# Altium schematic sheet 12V.SchDoc
size A; DocumentNumber: 4; SheetNumber: 4; SheetTotal: 6
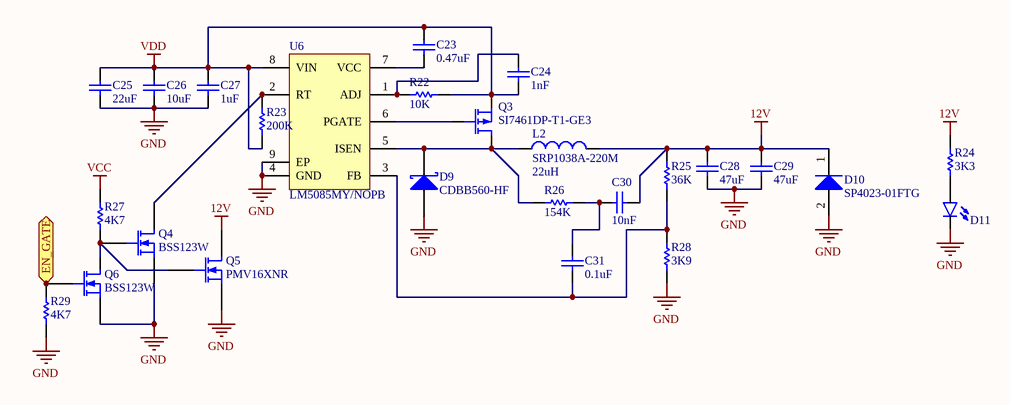
[diagram p0: 12V.SchDoc]

## Parts
C23  value 0.47uF  [C0603[1608X92]]  (hidden comment: 0.47uF 50V 0603)
C24  value 1nF  [C0402[1005X55]]  (hidden comment: 1nF 50V 0402)
C25  value 22uF  [C2220[5750X480]]  (hidden comment: 22uF 50V 2220)
C26  value 10uF  [C1206[3216X160]]  (hidden comment: 10uF 50V 1206)
C27  value 1uF  [C0603[1608X92]]  (hidden comment: 1uF 50V 0603)
C28  value 47uF  [C1210[3225X250]]  (hidden comment: 47uF 16V 1210)
C29  value 47uF  [C1210[3225X250]]  (hidden comment: 47uF 16V 1210)
C30  value 10nF  [C0402[1005X55]]  (hidden comment: 10nF 50V 0402)
C31  value 0.1uF  [C0402[1005X55]]  (hidden comment: 0.1uF 100VV 0402)
D9  CDBB560-HF  [SMB]
D10  SP4023-01FTG  [SOD323]
D11  LED-BLUE  [LED0603]  (value not drawn)
L2  SRP1038A-220M  value 22uH  [SRP1038A]
Q3  SI7461DP-T1-GE3  [SOT23-3]
Q4  BSS123W  [SOT323-3]
Q5  PMV16XNR  [SOT23-3]
Q6  BSS123W  [DPAK127P1525X483-7N]
R22  value 10K  [R0402[1005]]  (hidden comment: 10K 1% 0402)
R23  value 200K  [R0402[1005]]  (hidden comment: 200K 1% 0402)
R24  value 3K3  [R0402[1005]]  (hidden comment: 3K3 1% 0402)
R25  value 36K  [R0402[1005]]  (hidden comment: 36K 1% 0402)
R26  value 154K  [R0402[1005]]  (hidden comment: 154K 1% 0402)
R27  value 4K7  [R0402[1005]]  (hidden comment: 4K7 1% 0402)
R28  value 3K9  [R0402[1005]]  (hidden comment: 3K9 1% 0402)
R29  value 4K7  [R0402[1005]]  (hidden comment: 4K7 1% 0402)
U6  LM5085MY/NOPB  [MUY08A_N]

## Ports
EN_GATE (in)

## Nets
12V: C28.2 C29.2 C30.2 D10.1(K) L2.2 Q5.3(D) R24.2 R25.2
GND: C25.1 C26.1 C27.1 C28.1 C29.1 D9.1(A) D10.2(A) D11.C Q4.2(S) Q5.2(S) Q6.2(S) R28.1 R29.1 U6.4(GND) U6.9(EP)
VCC: R27.2
VDD: C23.2 C24.1 C25.2 C26.2 C27.2 Q3.3(S) R22.2 R23.1 U6.8(VIN)
EN_GATE: Q6.1(G) R29.2 ; port EN_GATE
NetC23_1: C23.1 U6.7(VCC)
NetC24_2: C24.2 R22.1 U6.1(ADJ)
NetC30_1: C30.1 C31.2 R26.2
NetC31_1: C31.1 R25.1 R28.2 U6.3(FB)
NetD9_2: D9.2(K) L2.1 Q3.2(D) R26.1 U6.5(ISEN)
NetD11_A: D11.A R24.1
NetQ3_1: Q3.1(G) U6.6(PGATE)
NetQ4_1: Q4.1(G) Q5.1(G) Q6.3(D) R27.1
NetQ4_3: Q4.3(D) R23.2 U6.2(RT)

## Library data of the parts
C23 = CAP_0.47uF_50V_0603_10%: 0.47uF 50V 10% 0603 (1608 Metric); PartNumber: GRM188R61H474KA12D; Manufacturer: Murata; Tolerance: 10%; Mounting Technology: Surface Mount; PackageReference: 0603; PackageDescription: 0603 (1608 Metric); Voltage: 50V
C24 = CAP_1nF_50V_0402_5%: 1nF 50V 5% 0402 (1005 Metric); PartNumber: GRM1555C1H102JA01D; Manufacturer: Murata; Tolerance: 5%; Mounting Technology: Surface Mount; PackageReference: 0402; PackageDescription: 0402 (1005 Metric); Voltage: 50V
C25 = CAP_22uF_50V_2220_20%: 22uF 50V 20% 2220 (5750 Metric); PartNumber: KRM55TR71H226MH01K; Manufacturer: Murata; Tolerance: 20%; Mounting Technology: Surface Mount; PackageReference: 2220; PackageDescription: 2220 (5750 Metric); Voltage: 50V
C26 = CAP_10uF_50V_1206_20%: 10uF 50V 20% 1206 (3216 Metric); PartNumber: UMK316BBJ106ML-T; Manufacturer: Taiyo Yuden; Tolerance: 20%; Mounting Technology: Surface Mount; PackageReference: 1206; PackageDescription: 1206 (3216 Metric); Voltage: 50V
C27 = CAP_1uF_50V_0603_10%: 1uF 50V 10% 0603 (1608 Metric); PartNumber: GRM188R61H105KAALD; Manufacturer: Murata; Tolerance: 10%; Mounting Technology: Surface Mount; PackageReference: 0603; PackageDescription: 0603 (1608 Metric); Voltage: 50V
C28 C29 = CAP_47uF_16V_1210_20%: 47uF 16V 20% 1210 (3225 Metric); PartNumber: GRM32ER61C476ME15L; Manufacturer: Murata; Tolerance: 20%; Mounting Technology: Surface Mount; PackageReference: 1210; PackageDescription: 1210 (3225 Metric); Voltage: 16V
C30 = CAP_10nF_50V_0402_10%: 10nF 50V 10% 0402 (1005 Metric); PartNumber: GCM155R71H103KA55D; Manufacturer: Murata; Tolerance: 10%; Mounting Technology: Surface Mount; PackageReference: 0402; PackageDescription: 0402 (1005 Metric); Voltage: 50V
C31 = CAP_0.1uF_100V_0402_10%: 0.1uF 100V 10% 0402 (1005 Metric); PartNumber: GRM155R62A104KE14D; Manufacturer: Murata; Tolerance: 10%; Mounting Technology: Surface Mount; PackageReference: 0402; PackageDescription: 0402 (1005 Metric); Voltage: 100V
D9 = CDBB560-HF: Manufacturer: Comchip Technology; PackageReference: DO-214AA; PackageDescription: DO-214-AA/SMB; 2 C-Bend Leads; Body 5.3 x 3.6 mm, inc. leads (LxW); PartNumber: CDBB560-HF; Mounting Technology: Surface Mount
D10 = SP4023-01FTG: Manufacturer: Littelfuse; PartNumber: SP4023-01FTG; PackageReference: SOD-323-2; PackageDescription: SOD323, 2-Leads; Mounting Technology: Surface Mount
D11 = LED_0603_BLUE_5mA: PartNumber: LTST-C193TBKT-5A; Manufacturer: Lite-On Inc.; PackageReference: 0603; PackageDescription: 0603 (1608 Metric); Mounting Technology: Surface Mount
L2 = SRP1038A-220M: 22uH 20% 7A 1038; Manufacturer: Bourns; PackageReference: SRP1038A; PartNumber: SRP1038A-220M; Mounting Technology: Surface Mount
Q3 = SI7461DP-T1-GE3: P-Channel MOSFET; Manufacturer: Vishay; PackageReference: PowerPAK SO-8; PartNumber: SI7461DP-T1-GE3; Mounting Technology: Surface Mount
Q4 Q6 = BSS123WQ-7-F: N-Channel MOSFET; Manufacturer: Diodes Incorporated; PackageReference: SOT-323-3; PartNumber: BSS123WQ-7-F; Mounting Technology: Surface Mount
Q5 = PMV16XNR: N-Channel MOSFET; pin to pad: 2>3 3>2; Manufacturer: NXP; PackageReference: SOT-23-3; PartNumber: PMV16XNR; Mounting Technology: Surface Mount
R22 = RES_10K_0402_1%: 10K 0.063W 1% 0402 (1005 Metric); Manufacturer: KOA Speer; PartNumber: RK73H1ETTP1002F; Tolerance: 1%; Power: 0.063W; Mounting Technology: Surface Mount; PackageReference: 0402; PackageDescription: 0402 (1005 Metric); ComponentLink1Description: Datasheet; ComponentLink1URL: http://www.koaspeer.com/catimages/Products/RK73H/RK73H.pdf
R23 = RES_200K_0402_1%: 200K 0.063W 1% 0402 (1005 Metric); Manufacturer: KOA Speer; PartNumber: RK73H1ETTP2003F; Tolerance: 1%; Power: 0.063W; Mounting Technology: Surface Mount; PackageReference: 0402; PackageDescription: 0402 (1005 Metric); ComponentLink1Description: Datasheet; ComponentLink1URL: http://www.koaspeer.com/catimages/Products/RK73H/RK73H.pdf
R24 = RES_3K3_0402_1%: 3K3 0.063W 1% 0402 (1005 Metric); Manufacturer: KOA Speer; PartNumber: RK73H1ETTP3301F; Power: 0.063W; Tolerance: 1%; Mounting Technology: Surface Mount; PackageReference: 0402; PackageDescription: 0402 (1005 Metric); ComponentLink1Description: Datasheet; ComponentLink1URL: http://www.koaspeer.com/catimages/Products/RK73H/RK73H.pdf
R25 = RES_36K_0402_1%: 36K 0.063W 1% 0402 (1005 Metric); Manufacturer: KOA Speer; PartNumber: RK73H1ETTP3602F; Power: 0.063W; Tolerance: 1%; Mounting Technology: Surface Mount; PackageReference: 0402; PackageDescription: 0402 (1005 Metric); ComponentLink1Description: Datasheet; ComponentLink1URL: http://www.koaspeer.com/catimages/Products/RK73H/RK73H.pdf
R26 = RES_154K_0402_1%: 154K 0.063W 1% 0402 (1005 Metric); Manufacturer: KOA Speer; PartNumber: RK73H1ETTP1543F; Power: 0.063W; Tolerance: 1%; Mounting Technology: Surface Mount; PackageReference: 0402; PackageDescription: 0402 (1005 Metric); ComponentLink1Description: Datasheet; ComponentLink1URL: http://www.koaspeer.com/catimages/Products/RK73H/RK73H.pdf
R27 R29 = RES_4K7_0402_1%: 4K7 0.063W 1% 0402 (1005 Metric); Manufacturer: KOA Speer; PartNumber: RK73H1ETTP4701F; Tolerance: 1%; Power: 0.063W; Mounting Technology: Surface Mount; PackageReference: 0402; PackageDescription: 0402 (1005 Metric); ComponentLink1Description: Datasheet; ComponentLink1URL: http://www.koaspeer.com/catimages/Products/RK73H/RK73H.pdf
R28 = RES_3K9_0402_1%: 3K9 0.063W 1% 0402 (1005 Metric); Manufacturer: KOA Speer; PartNumber: RK73H1ETTP3901F; Tolerance: 1%; Power: 0.063W; Mounting Technology: Surface Mount; PackageReference: 0402; PackageDescription: 0402 (1005 Metric); ComponentLink1Description: Datasheet; ComponentLink1URL: http://www.koaspeer.com/catimages/Products/RK73H/RK73H.pdf
U6 = CMP-0069-01314-2: 75V Constant On-Time PFET Buck Switching Controller, 8-pin eMSOP, Pb-Free; Manufacturer: Texas Instruments; CompType: Switcher; PackageTopMarking: ZXTT*SYCB; PowerWise: Y; ComponentLink3Description: MUY08A Package Page; ComponentLink1URL: http://www.national.com/ds/LM/LM5085.pdf; PackageReference: MSOP-8; RevisionNote: Component URLs added; ComponentLink3URL: http://www.national.com/packaging/folders/muy08a.html; DatasheetVersion: Dec-2009; ComponentLink1Description: LM5085 Datasheet; ComponentLink2URL: http://www.national.com/pf/LM/LM5085.html; RoHS: Y; PackageVersion: revA, Nov-2003; Code_JEDEC: MO-187-AA; PackageDescription: Molded Mini-SO, Exposed Pad, .118 x .118 x .034in Body, 8 Lead, .0256in Pitch; ComponentLink2Description: LM5085 Web Page; PinCount: 8; Mounting Technology: Surface Mount; PartNumber: LM5085MY